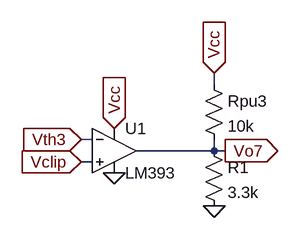
[diagram p0: schematic outputcomparator.asc]
outputcomparator.asc, the LTspice schematic file:
Version 4
SHEET 1 880 680
WIRE 272 112 272 96
WIRE 96 192 80 192
WIRE 272 208 272 192
WIRE 272 208 160 208
WIRE 288 208 272 208
WIRE 96 224 80 224
FLAG 128 240 0
FLAG 128 176 Vcc
IOPIN 128 176 In
FLAG 272 96 Vcc
IOPIN 272 96 In
FLAG 80 192 Vth3
IOPIN 80 192 In
FLAG 288 208 Vo7
IOPIN 288 208 Out
FLAG 80 224 Vclip
IOPIN 80 224 In
FLAG 272 288 0
SYMBOL OpAmps\\opamp2 128 144 R0
SYMATTR InstName U1
SYMATTR Value LM393
SYMBOL res 256 96 R0
SYMATTR InstName Rpu3
SYMATTR Value 10k
SYMBOL res 256 192 R0
SYMATTR InstName R1
SYMATTR Value 3.3k

The netlist it stands for:
* outputcomparator.asc
XU1 Vclip Vth3 Vcc 0 Vo7 LM393  ; pins In+ In- V+ V- OUT
Rpu3 Vcc Vo7 10k
R1 Vo7 0 3.3k
.backanno
.end